# Altium schematic sheet CON_SPDIF_INOUT_A.SchDoc: S/PDIF RCA IN/OUT
size A4; Organization: Altium Limited.; Address1: Level 3, 12a Rodborough Rd; Address2: Frenchs Forest 2086; Address3: NSW; Address4: AUSTRALIA; DocumentNumber: 51; SheetNumber: 52; SheetTotal: 78
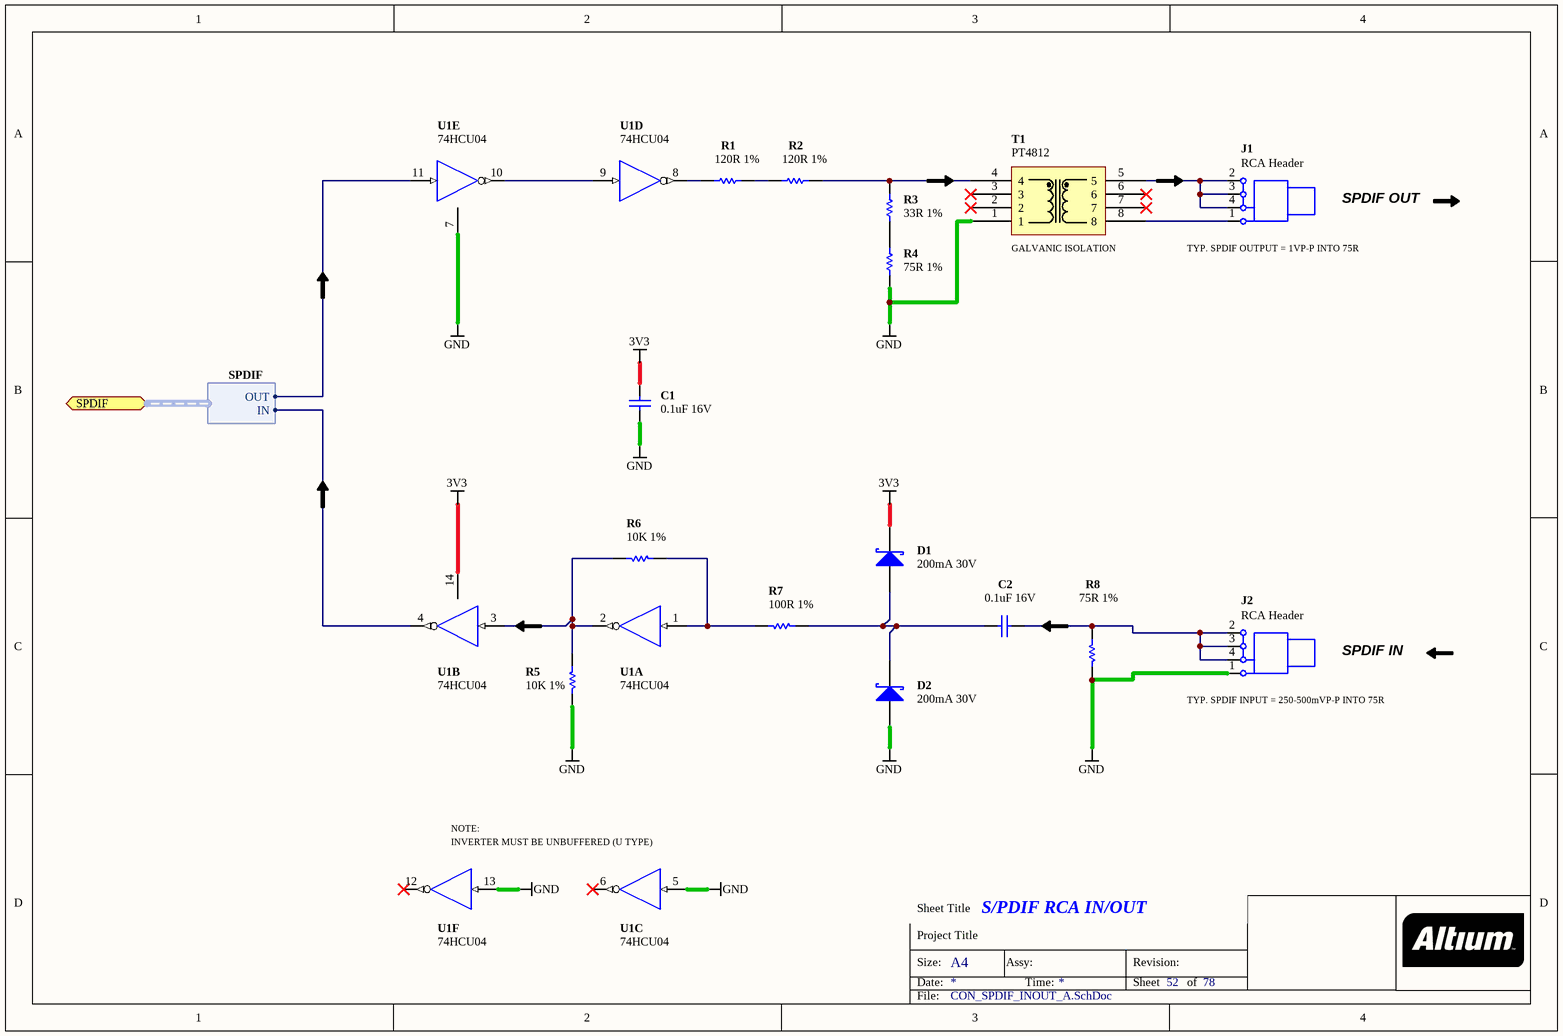
[diagram p0: CON_SPDIF_INOUT_A.SchDoc]

## Parts
C1  0.1uF 16V  [CAPC1005-STAR]
C2  0.1uF 16V  [CAPC1005-STAR]
D1  200mA 30V  [SOT95P230-3C]
D2  200mA 30V  [SOT95P230-3C]
J1  RCA Header  [TRC-005]
J2  RCA Header  [TRC-005]
R1  120R 1%  [RESC1005-STAR]
R2  120R 1%  [RESC1005-STAR]
R3  33R 1%  [RESC1005-STAR]
R4  75R 1%  [RESC1005-STAR]
R5  10K 1%  [RESC1005-STAR]
R6  10K 1%  [RESC1005-STAR]
R7  100R 1%  [RESC1005-STAR]
R8  75R 1%  [RESC1005-STAR]
T1  PT4812  [PT4812]
U1  74HCU04  [TSSOP14]  (parts A,B,C,D,E,F of 6)

## Ports
SPDIF (harness SPDIF)

## Harnesses
SPDIF: IN, OUT

## Nets
3V3: C1.2 D1.3(k) U1.14(VCC)
GND: C1.1 D2.1(A) J2.1(Black) R4.2 R5.1 R8.2 T1.1 U1.5(A) U1.7(GND) U1.13(A)
NetC2_1: C2.1 J2.2(Yellow) J2.3(White) J2.4(Red) R8.1
NetC2_2: C2.2 D1.1(A) D2.3(k) R7.2
NetJ1_1: J1.1(Black) T1.8
NetJ1_2: J1.2(Yellow) J1.3(White) J1.4(Red) T1.5
NetR1_1: R1.1 U1.8(Y)
NetR1_2: R1.2 R2.1
NetR2_2: R2.2 R3.2 T1.4
NetR3_1: R3.1 R4.1
NetR5_2: R5.2 R6.2 U1.2(Y) U1.3(A)
NetR6_1: R6.1 R7.1 U1.1(A)
NetU1_4: U1.4(Y) ; port SPDIF.IN
NetU1_9: U1.9(A) U1.10(Y)
NetU1_11: U1.11(A) ; port SPDIF.OUT

Not connected (* = marked no-connect by the designer): D1 2; D2 2; T1 2* 3* 6* 7*; U1 6(Y)* 12(Y)*

## Notes on the sheet
- (near T1) GALVANIC ISOLATION
- (near J1) TYP. SPDIF OUTPUT = 1VP-P INTO 75R
- SPDIF OUT
- SPDIF IN
- (near J2) TYP. SPDIF INPUT = 250-500mVP-P INTO 75R
- (near U1) NOTE:
- (near U1) INVERTER MUST BE UNBUFFERED (U TYPE)
- Sheet Title
- Project Title
- Size:
- Date:
- A4
- Assy:
- Time:
- Revision:
- Sheet
- of
- File:

## Library data of the parts
C1 C2 = D-101-0080: Capacitor, Ceramic, 0.1uF 10% 16V 0402 (1005) X7R; Polarity: Non-Polarized; Capacitance: 0.1 uF; Category: Capacitor; Dielectric: X7R; Mounting Technology: Surface Mount; Rated Voltage: 16 V; Status: Production; Technology: Ceramic; Tolerance: 10 %
D1 D2 = D-151-0002: Schottky Diode, BAT54 30V 200mA 30V SOT-23; Rated Voltage: 30 mV; Max Forward Current: 200 mA; Mounting Technology: Surface Mount; Status: Production; Category: Diode-Schottky
J1 J2 = D-300-0132: Connector, TRC-005-4 , Black RCA Phono Jack, Right Angle, Thru-Hole, Snap-In; Max Current: mA; Connector type: Header; Mounting Technology: Through-Hole; Status: Unreleased; Category: Connector
R1 R2 = D-100-0126: Resistor, 120R 1% 0402 (1005); Power Rating: 63 mW; Mounting Technology: Surface Mount; Resistance: 120 R; Status: Production; Tolerance: 1 %; Category: Resistor
R3 = D-100-0102: Resistor, 33R 1% 0402 (1005); Power Rating: 63 mW; Mounting Technology: Surface Mount; Resistance: 33 R; Status: Production; Tolerance: 1 %; Category: Resistor
R4 R8 = D-100-0001: Resistor, 75R 1% 0402; Power Rating: 1/16 W; Mounting Technology: Surface Mount; Resistance: 75 R; Status: Production; Tolerance: 1 %; Category: Resistor
R5 R6 = D-100-0130: Resistor, 10K 1% 0402 (1005); Power Rating: 63 mW; Mounting Technology: Surface Mount; Resistance: 10 K; Status: Production; Tolerance: 1 %; Category: Resistor
R7 = D-100-0131: Resistor, 100R 1% 0402 (1005); Power Rating: 63 mW; Mounting Technology: Surface Mount; Resistance: 100 R; Status: Production; Tolerance: 1 %; Category: Resistor
T1 = D-107-0004: Transformer, 1:1, SMD, 0 to 70 deg C,  1 to 7 Mbps, 500Vrms min; Status: Unreleased; Category: Transformer
U1 = D-205-0010: 74HCU04, HEX Inverter, Unbuffered; Mounting Technology: Surface Mount; Status: Production; Category: IC-Logic